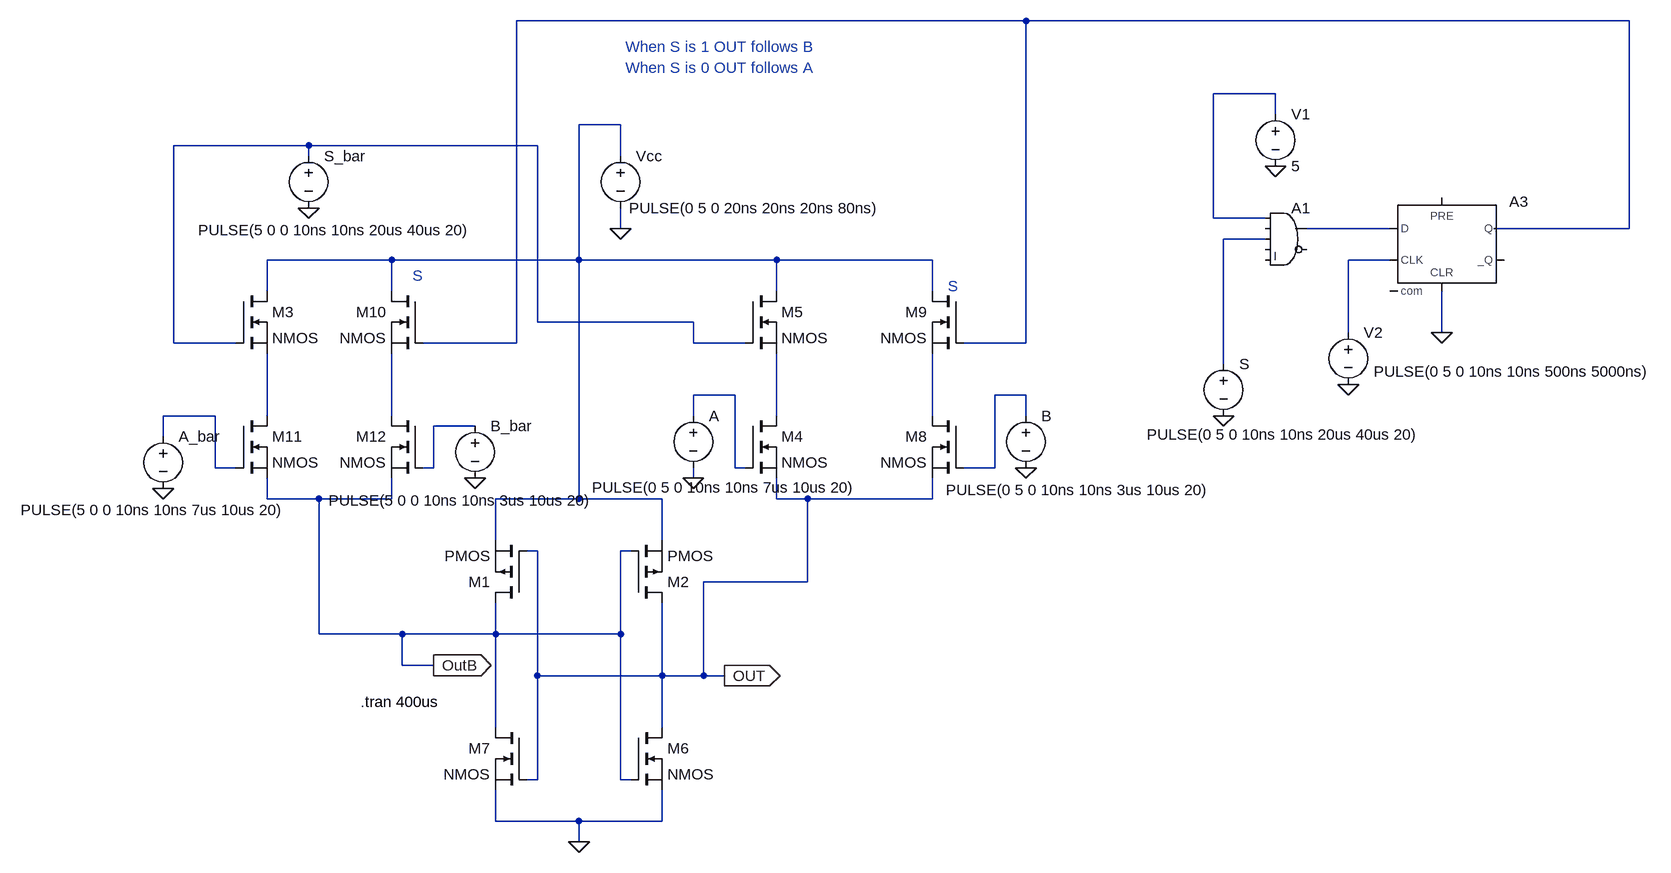
[diagram p0: schematic mux1.asc]
mux1.asc, the LTspice schematic file:
Version 4
SHEET 1 2804 688
WIRE 976 -704 192 -704
WIRE 1904 -704 976 -704
WIRE 1360 -592 1264 -592
WIRE 1360 -560 1360 -592
WIRE 352 -544 288 -544
WIRE -128 -512 -336 -512
WIRE 224 -512 -128 -512
WIRE -128 -496 -128 -512
WIRE 352 -496 352 -544
WIRE 1264 -400 1264 -592
WIRE 1344 -400 1264 -400
WIRE 352 -384 352 -416
WIRE 1536 -384 1408 -384
WIRE 1904 -384 1904 -704
WIRE 1904 -384 1696 -384
WIRE 1344 -368 1280 -368
WIRE 0 -336 -192 -336
WIRE 288 -336 288 -544
WIRE 288 -336 0 -336
WIRE 592 -336 288 -336
WIRE 832 -336 592 -336
WIRE 1536 -336 1472 -336
WIRE -192 -288 -192 -336
WIRE 0 -288 0 -336
WIRE 592 -288 592 -336
WIRE 832 -288 832 -336
WIRE 224 -240 224 -512
WIRE 464 -240 224 -240
WIRE 1472 -224 1472 -336
WIRE 1616 -224 1616 -288
WIRE -336 -208 -336 -512
WIRE -240 -208 -336 -208
WIRE 192 -208 192 -704
WIRE 192 -208 48 -208
WIRE 464 -208 464 -240
WIRE 544 -208 464 -208
WIRE 976 -208 976 -704
WIRE 976 -208 880 -208
WIRE 1280 -176 1280 -368
WIRE 528 -128 464 -128
WIRE 976 -128 928 -128
WIRE -272 -96 -352 -96
WIRE -192 -96 -192 -192
WIRE 0 -96 0 -192
WIRE 464 -96 464 -128
WIRE 592 -96 592 -192
WIRE 832 -96 832 -192
WIRE 976 -96 976 -128
WIRE 128 -80 64 -80
WIRE -352 -64 -352 -96
WIRE -272 -16 -272 -96
WIRE -240 -16 -272 -16
WIRE 64 -16 64 -80
WIRE 64 -16 48 -16
WIRE 528 -16 528 -128
WIRE 544 -16 528 -16
WIRE 928 -16 928 -128
WIRE 928 -16 880 -16
WIRE 464 0 464 -16
WIRE -192 32 -192 0
WIRE -112 32 -192 32
WIRE 0 32 0 0
WIRE 0 32 -112 32
WIRE 288 32 288 -336
WIRE 288 32 160 32
WIRE 416 32 288 32
WIRE 592 32 592 0
WIRE 640 32 592 32
WIRE 832 32 832 0
WIRE 832 32 640 32
WIRE 160 96 160 32
WIRE 416 96 416 32
WIRE 224 112 208 112
WIRE 368 112 352 112
WIRE 640 160 640 32
WIRE 640 160 480 160
WIRE -112 240 -112 32
WIRE 16 240 -112 240
WIRE 160 240 160 192
WIRE 160 240 16 240
WIRE 352 240 352 112
WIRE 352 240 160 240
WIRE 16 288 16 240
WIRE 64 288 16 288
WIRE 224 304 224 112
WIRE 416 304 416 192
WIRE 416 304 224 304
WIRE 480 304 480 160
WIRE 480 304 416 304
WIRE 512 304 480 304
WIRE 160 384 160 240
WIRE 416 384 416 304
WIRE 224 464 224 304
WIRE 224 464 208 464
WIRE 352 464 352 240
WIRE 368 464 352 464
WIRE 160 528 160 480
WIRE 288 528 160 528
WIRE 416 528 416 480
WIRE 416 528 288 528
WIRE 288 560 288 528
FLAG 352 -384 0
FLAG 288 560 0
FLAG -352 16 0
FLAG -128 -416 0
FLAG 1280 -96 0
FLAG 128 0 0
FLAG 464 0 0
FLAG 976 -16 0
FLAG 64 288 OutB
IOPIN 64 288 Out
FLAG 512 304 OUT
IOPIN 512 304 Out
FLAG 1360 -480 0
FLAG 1616 -224 0
FLAG 1472 -144 0
SYMBOL pmos 208 192 R180
SYMATTR InstName M1
SYMBOL pmos 368 192 M180
SYMATTR InstName M2
SYMBOL nmos -240 -288 R0
SYMATTR InstName M3
SYMBOL nmos 544 -96 R0
SYMATTR InstName M4
SYMBOL nmos 544 -288 R0
SYMATTR InstName M5
SYMBOL nmos 368 384 R0
SYMATTR InstName M6
SYMBOL nmos 208 384 M0
SYMATTR InstName M7
SYMBOL nmos 880 -96 M0
SYMATTR InstName M8
SYMBOL nmos 880 -288 M0
SYMATTR InstName M9
SYMBOL nmos 48 -288 M0
SYMATTR InstName M10
SYMBOL nmos -240 -96 R0
SYMATTR InstName M11
SYMBOL nmos 48 -96 M0
SYMATTR InstName M12
SYMBOL voltage 352 -512 R0
WINDOW 123 0 0 Left 0
WINDOW 39 0 0 Left 0
WINDOW 3 13 96 Left 2
SYMATTR Value PULSE(0 5 0 20ns 20ns 20ns 80ns)
SYMATTR InstName Vcc
SYMBOL voltage 976 -112 R0
WINDOW 123 0 0 Left 0
WINDOW 39 0 0 Left 0
WINDOW 3 -123 130 Left 2
SYMATTR Value PULSE(0 5 0 10ns 10ns 3us 10us 20)
SYMATTR InstName B
SYMBOL voltage 1280 -192 R0
WINDOW 3 -118 125 Left 2
WINDOW 123 0 0 Left 0
WINDOW 39 0 0 Left 0
SYMATTR Value PULSE(0 5 0 10ns 10ns 20us 40us 20)
SYMATTR InstName S
SYMBOL voltage -128 -512 R0
WINDOW 123 0 0 Left 0
WINDOW 39 0 0 Left 0
WINDOW 3 -170 130 Left 2
SYMATTR Value PULSE(5 0 0 10ns 10ns 20us 40us 20)
SYMATTR InstName S_bar
SYMBOL voltage -352 -80 R0
WINDOW 3 -219 129 Left 2
WINDOW 123 0 0 Left 0
WINDOW 39 0 0 Left 0
SYMATTR Value PULSE(5 0 0 10ns 10ns 7us 10us 20)
SYMATTR InstName A_bar
SYMBOL voltage 464 -112 R0
WINDOW 3 -156 126 Left 2
WINDOW 123 0 0 Left 0
WINDOW 39 0 0 Left 0
SYMATTR Value PULSE(0 5 0 10ns 10ns 7us 10us 20)
SYMATTR InstName A
SYMBOL voltage 128 -96 R0
WINDOW 3 -225 130 Left 2
WINDOW 123 0 0 Left 0
WINDOW 39 0 0 Left 0
SYMATTR Value PULSE(5 0 0 10ns 10ns 3us 10us 20)
SYMATTR InstName B_bar
SYMBOL Digital\\and 1376 -432 R0
SYMATTR InstName A1
SYMBOL voltage 1360 -576 R0
WINDOW 123 0 0 Left 0
WINDOW 39 0 0 Left 0
SYMATTR InstName V1
SYMATTR Value 5
SYMBOL Digital\\dflop 1616 -432 R0
SYMATTR InstName A3
SYMBOL voltage 1472 -240 R0
WINDOW 3 39 76 Left 2
WINDOW 123 0 0 Left 0
WINDOW 39 0 0 Left 0
SYMATTR Value PULSE(0 5 0 10ns 10ns 500ns 5000ns)
SYMATTR InstName V2
TEXT -48 344 Left 2 !.tran 400us
TEXT 360 -664 Left 2 ;When S is 1 OUT follows B
TEXT 360 -632 Left 2 ;When S is 0 OUT follows A
TEXT 856 -296 Left 2 ;S
TEXT 32 -312 Left 2 ;S

The netlist it stands for:
* mux1.asc
M1 OutB OUT N003 N003 PMOS
M2 OUT OutB N003 N003 PMOS
M3 N003 N004 N011 N011 NMOS
M4 N013 N008 OUT OUT NMOS
M5 N003 N004 N013 N013 NMOS
M6 OUT OutB 0 0 NMOS
M7 OutB OUT 0 0 NMOS
M8 N014 N009 OUT OUT NMOS
M9 N003 N001 N014 N014 NMOS
M10 N003 N001 N012 N012 NMOS
M11 N011 N010 OutB OutB NMOS
M12 N012 N015 OutB OutB NMOS
Vcc N003 0 PULSE(0 5 0 20ns 20ns 20ns 80ns)
V§B N009 0 PULSE(0 5 0 10ns 10ns 3us 10us 20)
V§S N006 0 PULSE(0 5 0 10ns 10ns 20us 40us 20)
V§S_bar N004 0 PULSE(5 0 0 10ns 10ns 20us 40us 20)
V§A_bar N010 0 PULSE(5 0 0 10ns 10ns 7us 10us 20)
V§A N008 0 PULSE(0 5 0 10ns 10ns 7us 10us 20)
V§B_bar N015 0 PULSE(5 0 0 10ns 10ns 3us 10us 20)
A1 N002 0 N006 0 0 0 N005 0 AND
V1 N002 0 5
A3 N005 0 N007 0 0 0 N001 0 DFLOP
V2 N007 0 PULSE(0 5 0 10ns 10ns 500ns 5000ns)
.model NMOS NMOS
.model PMOS PMOS
.lib standard.mos
.tran 400us
* When S is 1 OUT follows B
* When S is 0 OUT follows A
* S
* S
.backanno
.end